# EasyEDA Pro project ProPrj_MSP3507拓展板_2025-07-14_10-12-05_2025-07-20.epro, schematic Schematic1
Board Name: Board1; Create Date: 2025-07-19; Page Name: P1; Project Name: MSP3507拓展板_2025-07-14_10-12-05; Schematic Name: Schematic1; Update Date: 2025-07-20; Add into BOM: yes; Company: 嘉立创EDA; Convert to PCB: yes; Page Size: A4; Version: V1.0
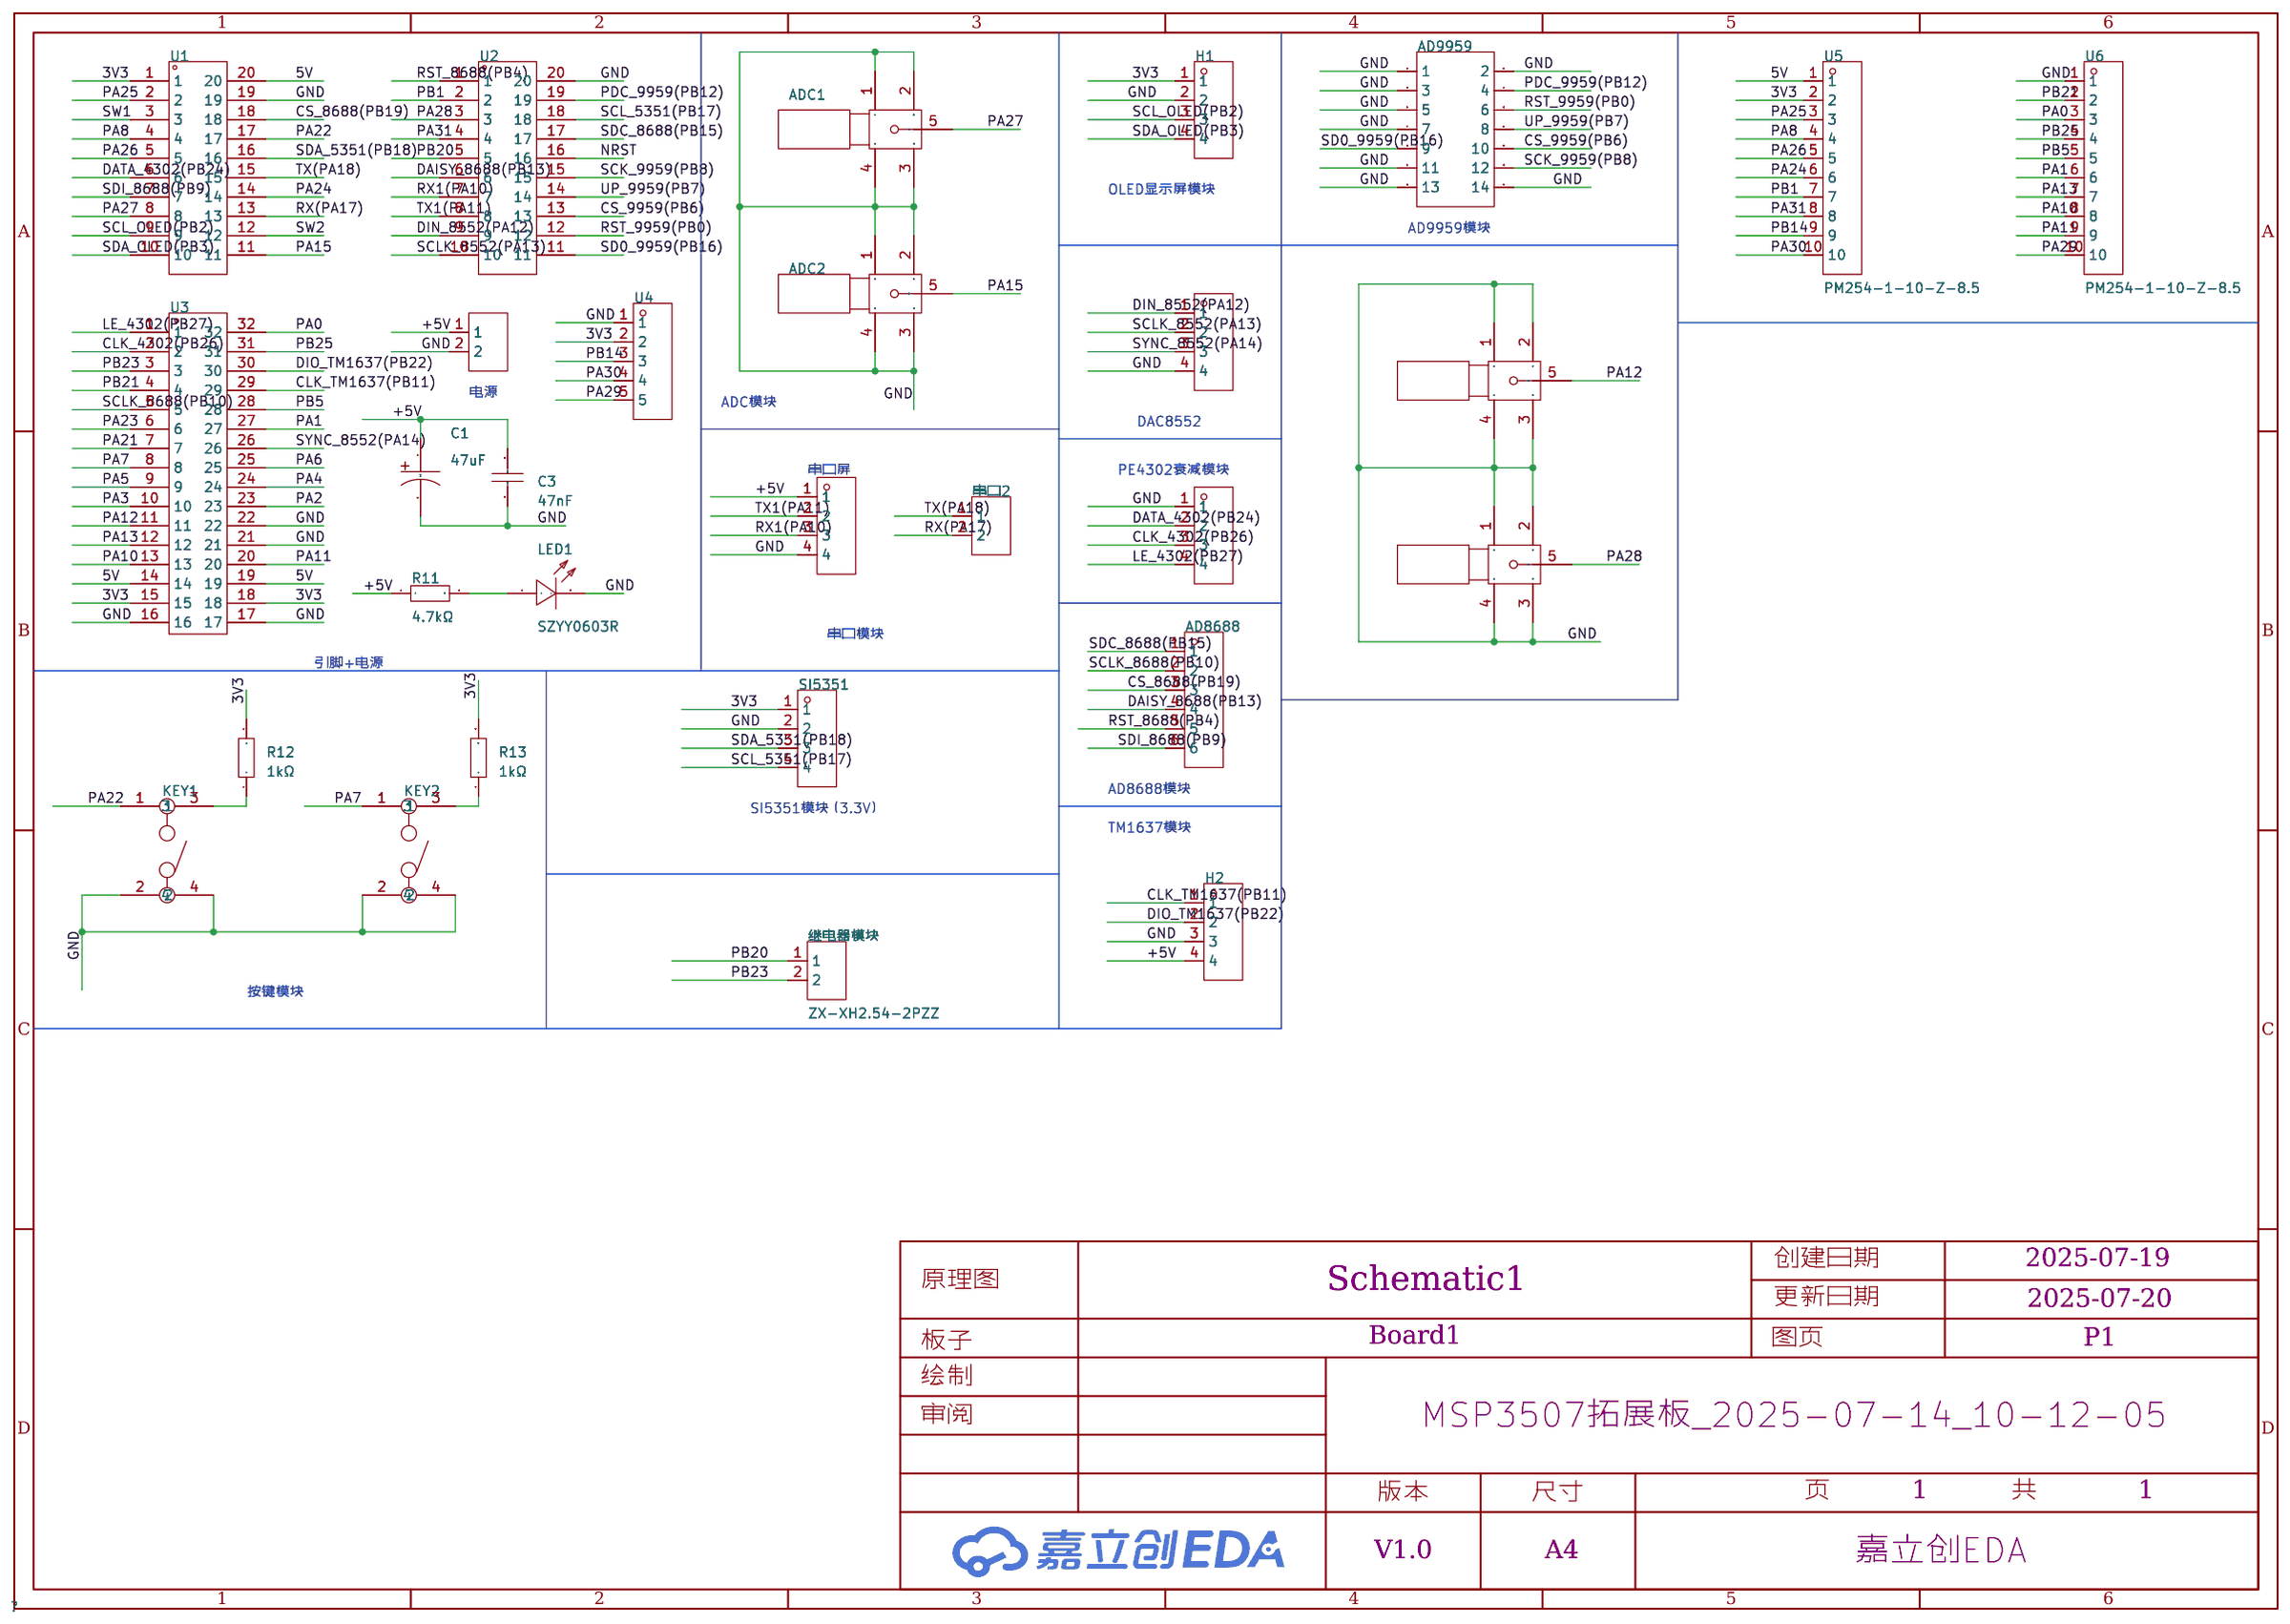
[diagram p0: schematic sheet]

## Parts
AD8688  ZX-XH2.54-6PZZ  [CONN-TH_6P-P2.50_ZX-XH2.54-6PZZ]
AD9959  2.54-2*7P简牛  [IDC-TH_14P-P2.54-V-R2-C7-S2.54]
ADC1  BWSMA-KE-P001  [SMA-SMD_BWSMA-KE-P001]
ADC2  BWSMA-KE-P001  [SMA-SMD_BWSMA-KE-P001]
C1  47uF  [CAP-TH_BD5.0-P2.00-D0.8-FD]
C3  47nF  [C0805]
DAC1  BWSMA-KE-P001  [SMA-SMD_BWSMA-KE-P001]
DAC2  BWSMA-KE-P001  [SMA-SMD_BWSMA-KE-P001]
H1  -  [HDR-TH_4P-P2.54-V-F]
H2  -  [HDR-TH_4P-P2.54-V-F]
KEY1  -  [4角直插式开关]
KEY2  -  [4角直插式开关]
LED1  SZYY0603R  [LED0603-R-RD]
OLED显示屏模块1  ZX-XH2.54-4PZZ  [CONN-TH_4P-P2.50_4PIN]
OLED显示屏模块2  ZX-XH2.54-4PZZ  [CONN-TH_4P-P2.50_4PIN]
OLED显示屏模块3  ZX-XH2.54-4PZZ  [CONN-TH_4P-P2.50_4PIN]
R11  4.7kΩ  [R0805]
R12  1kΩ  [R0805]
R13  1kΩ  [R0805]
SI5351  ZX-XH2.54-4PZZ  [CONN-TH_4P-P2.50_4PIN]
U1  -  [2*10Pin排针]
U2  -  [2*10Pin排针]
U3  -  [2*16Pin排针]
U4  PZ254V-11-05P  [HDR-TH_5P-P2.54-V-M]
U5  PM254-1-10-Z-8.5  [HDR-TH_10P-P2.54-V-F]
U6  PM254-1-10-Z-8.5  [HDR-TH_10P-P2.54-V-F]
串口1  ZX-XH2.54-2PZZ  [CONN-TH_2P-P2.50_HX25003-2A]
串口2  ZX-XH2.54-2PZZ  [CONN-TH_2P-P2.50_HX25003-2A]
继电器模块  ZX-XH2.54-2PZZ  [CONN-TH_2P-P2.50_HX25003-2A]

## Library data of the parts
AD8688 = ZX-XH2.54-6PZZ: 插针结构:1x6P;间距:2.5mm;安装方式:直插;参考系列:XH;总PIN数:6P;排数:1;每排PIN数:6;行距:-;额定电流:3A;触头材质:黄铜;触头镀层:锡;工作温度:-25℃~+85℃;; LCSC Part Name: 1x6P 间距:2.5mm 直插 系列:XH; Supplier Part: C7429636; Manufacturer: Megastar(兆星); Supplier Footprint: 插件,P=2.5mm; JLCPCB Part Class: 扩展库; Datasheet: https://atta.szlcsc.com/upload/public/pdf/source/20230619/1243AD0A516E39CD3D274D8985780568.pdf; Supplier: LCSC; Pins Structure: 1x6P; Pitch: 2.5mm; Mounting Type: 直插; Reference Series: XH; Number of Pins: 6P; Number of Rows: 1; Number of PINs Per Row: 6; Current Rating: 3A; Contact Material: 黄铜; Contact Plating: 锡; Operating Temperature: -25℃~+85℃; Voltage Rating: 250V; Plastic Material: PA66; Flame Retardant Rating: UL94V-0; Color: 白色; Z-Height of the Board: 7mm; X-Length of Bottom Edge on Board (Spacing Line): 17.5mm; Y-Width of Bottom Edge on Board: 5.9mm
AD9959 = 2.54-2*7P简牛: 连接器类型:简牛座;间距:2.54mm;结构:2x7P;封装形式:直插;行距:2.54mm;排数:2;每排PIN数:7;触头材质:黄铜;触头镀层:金;; LCSC Part Name: 2.54mm 2x7P 排数:2 每排P数:7; Supplier Part: C11215; Manufacturer: BOOMELE(博穆精密); Supplier Footprint: 插件,P=2.54mm; Datasheet: https://atta.szlcsc.com/upload/public/pdf/source/20131122/1457706661483.pdf; Supplier: LCSC; Connector Type: 简牛座; Pitch: 2.54mm; Structure: 2x7P; Holder Type: 直插; Row Spacing: 2.54mm; Number of Rows: 2; Pin Number in each Row: 7; Contact Material: 黄铜; Contact Plating: 金
ADC1 ADC2 DAC1 DAC2 = BWSMA-KE-P001: 连接器类型:板端;接口类型:内孔;端口数量:1;接口直径:5.2mm;接口长度/高度:-;频率-最大值:-;射频系列:SMA;阻抗:50Ω;样式:偏脚;工作温度范围:-;; LCSC Part Name: 内孔 SMA 偏脚; Supplier Part: C496550; Manufacturer: BAT WIRELESS(蝙蝠无线); Supplier Footprint: SMD; Datasheet: https://atta.szlcsc.com/upload/public/pdf/source/20240320/28FD502871C976DFF213ABFCF2A0ED51.pdf; Supplier: LCSC; Connector Type: 板端; Interface Type: 内孔; Number of Ports: 1; Interface Diameter: 5.2mm; RF Series: SMA; Impedance: 50Ω; Style: 偏脚
C1 = NXB25V47M5*11 2.5TP: 容值:47uF;精度:±20%;额定电压:25V;纹波电流:250mA@100kHz;等效串联电阻(ESR):300mΩ@100kHz;; LCSC Part Name: 47uF ±20% 25V; Supplier Part: C371230; Manufacturer: SAMYOUNG(韩国三莹); Supplier Footprint: 插件,D5xL11mm; JLCPCB Part Class: 扩展库; Datasheet: https://atta.szlcsc.com/upload/public/pdf/source/20190227/C371244_FA85FFEFC2961227CF12E3CCE8C34A7D.pdf; Supplier: LCSC; Tolerance: ±20%; Voltage Rating: 25V; Ripple Current: 250mA@100kHz; Equivalent Series Resistance(ESR): 300mΩ@100kHz; Pin Spacing: 2mm; Diameter: 5mm; Height - Seated (Max): 11mm; Lifetime: 2000hrs@105℃; Operating Temperature: -40℃~+105℃
C3 = CL21B473KBCNNNC: 容值:47nF;精度:±10%;额定电压:50V;材质(温度系数):X7R;; LCSC Part Name: 47nF ±10% 50V; Supplier Part: C53134; Manufacturer: SAMSUNG(三星); Supplier Footprint: 0805; JLCPCB Part Class: 基础库; Datasheet: https://atta.szlcsc.com/upload/public/pdf/source/20160218/1457707763339.pdf; Supplier: LCSC; Tolerance: ±10%; Voltage Rated: 50V; Temperature Coefficient: X7R
H1 H2 = HDR-F_2.54_1x4P: Supplier Part: C2718488; Supplier Footprint: 插件; JLCPCB Part Class: 扩展库
KEY1 KEY2 = 4角直插式开关: 4.5*4.5*3.8
LED1 = SZYY0603R: 发光颜色:红色;功率:40mW;正向电流:20mA;主波长:615nm~630nm;二极管配置:-;透镜颜色:无色透明透镜;色温:-;发光角度:120°;载带方式:-;工作温度:-40℃~+85℃;; LCSC Part Name: 红灯; Supplier Part: C434419; Manufacturer: yongyu(永裕光电); Supplier Footprint: 0603; JLCPCB Part Class: 扩展库; Datasheet: https://atta.szlcsc.com/upload/public/pdf/source/20191204/C434419_0B955C1F73FF88449D9A795B6FF49070.pdf; Supplier: LCSC; Emitted Color: 红色; Power Dissipation: 40mW; Forward Current: 20mA; Dominant Wavelength: 615nm~630nm; Peak Wavelength: 645nm; Lens Color: 无色透明透镜; Viewing Angle: 120°; Operating Temperature: -40℃~+85℃
OLED显示屏模块1-OLED显示屏模块3 SI5351 = ZX-XH2.54-4PZZ: 插针结构:1x4P;间距:2.5mm;安装方式:直插;参考系列:XH;总PIN数:4P;排数:1;每排PIN数:4;行距:-;额定电流:3A;触头材质:黄铜;触头镀层:锡;工作温度:-25℃~+85℃;; LCSC Part Name: 1x4P 间距:2.5mm 直插 系列:XH; Supplier Part: C7429634; Manufacturer: Megastar(兆星); Supplier Footprint: 插件,P=2.5mm; JLCPCB Part Class: 扩展库; Datasheet: https://atta.szlcsc.com/upload/public/pdf/source/20230619/B529A2163E0159A644AB3383D208FB03.pdf; Supplier: LCSC; Pins Structure: 1x4P; Pitch: 2.5mm; Mounting Type: 直插; Reference Series: XH; Number of Pins: 4P; Number of Rows: 1; Number of PINs Per Row: 4; Current Rating: 3A; Contact Material: 黄铜; Contact Plating: 锡; Operating Temperature: -25℃~+85℃; Voltage Rating: 250V; Plastic Material: PA66; Flame Retardant Rating: UL94V-0; Color: 白色; Z-Height of the Board: 7mm; X-Length of Bottom Edge on Board (Spacing Line): 12.5mm; Y-Width of Bottom Edge on Board: 5.9mm
R11 = 0805W8F4701T5E: 电阻类型:厚膜电阻;阻值:4.7kΩ;精度:±1%;功率:125mW;最大工作电压:150V;温度系数:±100ppm/℃;; LCSC Part Name: 4.7kΩ ±1% 125mW 厚膜电阻; Supplier Part: C17673; Manufacturer: UNI-ROYAL(厚声); Supplier Footprint: 0805; JLCPCB Part Class: 基础库; Datasheet: https://atta.szlcsc.com/upload/public/pdf/source/20200306/C422600_1E6D84923E4A46A82E41ADD87F860B5C.pdf; Supplier: LCSC; Type: 厚膜电阻; Tolerance: ±1%; Power(Watts): 125mW; Overload Voltage (Max): 150V; Temperature Coefficient: ±100ppm/℃; Operating Temperature Range: -55℃~+155℃
R12 R13 = 0805W8F1001T5E: 电阻类型:厚膜电阻;阻值:1kΩ;精度:±1%;功率:125mW;温度系数:±100ppm/℃;最大工作电压:150V;工作温度范围:-55℃~+155℃;; LCSC Part Name: 1kΩ ±1% 125mW; Supplier Part: C17513; Manufacturer: UNI-ROYAL(厚声); Supplier Footprint: 0805; JLCPCB Part Class: Basic Part; Datasheet: https://atta.szlcsc.com/upload/public/pdf/source/20200306/C422600_1E6D84923E4A46A82E41ADD87F860B5C.pdf; Supplier: LCSC; Type: 厚膜电阻; Tolerance: ±1%; Power(Watts): 125mW; Temperature Coefficient: ±100ppm/℃; Overload Voltage (Max): 150V; Operating Temperature Range: -55℃~+155℃
U1 U2 = 2*10Pin排针: 2.54
U3 = 2*16Pin排针: 2.54
U4 = PZ254V-11-05P: 间距:2.54mm;总PIN位数:5;排数:1;插针结构:1x5P;行距:-;安装类型:直插;圆针/方针:方针;额定电流:-;额定电压:-;配合针长度:6mm;塑高:2.5mm;端接针长度:3mm;触头材质:黄铜;触头镀层:-;工作温度范围:-40℃~+105℃;颜色:黑色;; LCSC Part Name: 2.54mm 1x5P 直插 方针; Supplier Part: C492404; Manufacturer: XFCN(兴飞); Supplier Footprint: 直插,P=2.54mm; JLCPCB Part Class: Extended Part; Datasheet: https://atta.szlcsc.com/upload/public/pdf/source/20200309/C492404_E51533260F8710EFF5D4617281164C1D.pdf; Supplier: LCSC; Pitch: 2.54mm; Number of Pins: 5; Number of Rows: 1; Pin Structure: 1x5P; Mounting Type: 直插; Circluar Pins/Square Pins: 方针; Length of Mating Pin: 6mm; Insulation Height: 2.5mm; Length of End Connection Pin: 3mm; Contact Material: 黄铜; Operating Temperature Range: -40℃~+105℃; Color: 黑色
U5 U6 = PM254-1-10-Z-8.5: 插孔结构:1x10P;间距:2.54mm;行距:-;圆孔/方孔:方孔;安装类型:直插;排数:单排;总孔位数:10P;额定电流:3A;额定电压:-;插孔方向:顶部;塑高:8.5mm;触头材质:铜合金;工作温度范围:-40℃~+105℃;焊接温度(最大值):260℃@5S;; LCSC Part Name: 1x10P 间距:2.54mm 直插; Supplier Part: C2897373; Manufacturer: HCTL(华灿天禄); Supplier Footprint: 插件,P=2.54mm; JLCPCB Part Class: 扩展库; Datasheet: https://atta.szlcsc.com/upload/public/pdf/source/20230609/534BE42964C679BDE98E061007C4ABD6.pdf; Supplier: LCSC; Holes Structure: 1x10P; Pitch: 2.54mm; Circular Hole / Square Hole: 方孔; Mounting Type: 直插; Number of Rows: 单排; Number of Holes: 10P; Current Rating (Max): 3A; Holes Direction: 顶部; Insulation Height: 8.5mm; Contact Material: 铜合金; Operating Temperature Range: -40℃~+105℃; Soldering Temperature(Max): 260℃@5S
串口1 串口2 继电器模块 = ZX-XH2.54-2PZZ: 插针结构:1x2P;间距:2.5mm;安装方式:直插;参考系列:XH;总PIN数:2P;排数:1;每排PIN数:2;行距:-;额定电流:3A;触头材质:黄铜;触头镀层:锡;工作温度:-25℃~+85℃;; LCSC Part Name: 1x2P 间距:2.5mm 直插 系列:XH; Supplier Part: C7429632; Manufacturer: Megastar(兆星); Supplier Footprint: 插件,P=2.5mm; JLCPCB Part Class: 扩展库; Datasheet: https://atta.szlcsc.com/upload/public/pdf/source/20230619/19BA6947230AA44A04D3EDD65E618FD0.pdf; Supplier: LCSC; Pins Structure: 1x2P; Pitch: 2.5mm; Mounting Type: 直插; Reference Series: XH; Number of Pins: 2P; Number of Rows: 1; Number of PINs Per Row: 2; Current Rating: 3A; Contact Material: 黄铜; Contact Plating: 锡; Operating Temperature: -25℃~+85℃; Voltage Rating: 250V; Plastic Material: PA66; Flame Retardant Rating: UL94V-0; Color: 白色; Z-Height of the Board: 7mm; X-Length of Bottom Edge on Board (Spacing Line): 7.5mm; Y-Width of Bottom Edge on Board: 5.9mm

## Nets
3V3: H1.1 R12.2 R13.2 SI5351.1 U1.1 U3.15 U3.18 U4.2 U5.2
5V: U1.20 U3.14 U3.19 U5.1
+5V: C1.1 C3.2 H2.4 OLED显示屏模块2.1 R11.1 串口1.1
GND: AD9959.1 AD9959.2 AD9959.3 AD9959.5 AD9959.7 AD9959.11 AD9959.13 AD9959.14 ADC1.1 ADC1.2 ADC1.3 ADC1.4 ADC2.1 ADC2.2 ADC2.3 ADC2.4 C1.2 C3.1 DAC1.1 DAC1.2 DAC1.3 DAC1.4 DAC2.1 DAC2.2 DAC2.3 DAC2.4 H1.2 H2.3 KEY1.2 KEY1.4 KEY2.2 KEY2.4 LED1.2(-) OLED显示屏模块1.1 OLED显示屏模块2.4 OLED显示屏模块3.4 SI5351.2 U1.19 U2.20 U3.16 U3.17 U3.21 U3.22 U4.1 U6.1 串口1.2
CLK_4302(PB26): OLED显示屏模块1.3 U3.2
CLK_TM1637(PB11): H2.1 U3.29
CS_8688(PB19): AD8688.3 U1.18
CS_9959(PB6): AD9959.10 U2.13
DAISY_8688(PB13): AD8688.4 U2.6
DATA_4302(PB24): OLED显示屏模块1.2 U1.6
DIN_8552(PA12): OLED显示屏模块3.1 U2.9
DIO_TM1637(PB22): H2.2 U3.30
LE_4302(PB27): OLED显示屏模块1.4 U3.1
NRST: U2.16
PA0: U3.32 U6.3
PA1: U3.27 U6.6
PA2: U3.23
PA3: U3.10
PA4: U3.24
PA5: U3.9
PA6: U3.25
PA7: KEY2.1 U3.8
PA8: U1.4 U5.4
PA10: U3.13 U6.8
PA11: U3.20 U6.9
PA12: DAC1.5 U3.11
PA13: U3.12 U6.7
PA15: ADC2.5 U1.11
PA21: U3.7
PA22: KEY1.1 U1.17
PA23: U3.6
PA24: U1.14 U5.6
PA25: U1.2 U5.3
PA26: U1.5 U5.5
PA27: ADC1.5 U1.8
PA28: DAC2.5 U2.3
PA29: U4.5 U6.10
PA30: U4.4 U5.10
PA31: U2.4 U5.8
PB1: U2.2 U5.7
PB5: U3.28 U6.5
PB14: U4.3 U5.9
PB20: U2.5 继电器模块.1
PB21: U3.4 U6.2
PB23: U3.3 继电器模块.2
PB25: U3.31 U6.4
PDC_9959(PB12): AD9959.4 U2.19
RST_8688(PB4): AD8688.5 U2.1
RST_9959(PB0): AD9959.6 U2.12
RX1(PA10): OLED显示屏模块2.3 U2.7
RX(PA17): U1.13 串口2.2
SCK_9959(PB8): AD9959.12 U2.15
SCL_5351(PB17): SI5351.4 U2.18
SCL_OLED(PB2): H1.3 U1.9
SCLK_8552(PA13): OLED显示屏模块3.2 U2.10
SCLK_8688(PB10): AD8688.2 U3.5
SD0_9959(PB16): AD9959.9 U2.11
SDA_5351(PB18): SI5351.3 U1.16
SDA_OLED(PB3): H1.4 U1.10
SDC_8688(PB15): AD8688.1 U2.17
SDI_8688(PB9): AD8688.6 U1.7
SW1: U1.3
SW2: U1.12
SYNC_8552(PA14): OLED显示屏模块3.3 U3.26
TX1(PA11): OLED显示屏模块2.2 U2.8
TX(PA18): U1.15 串口2.1
UP_9959(PB7): AD9959.8 U2.14
$1N1385: LED1.1(+) R11.2
$1N2419: KEY1.3 R12.1
$1N2433: KEY2.3 R13.1

## Notes on the sheet
- OLED显示屏模块
- AD9959模块
- 电源
- ADC模块
- DAC8552
- 串口屏
- PE4302衰减模块
- 串口模块
- 引脚+电源
- AD8688模块
- SI5351模块（3.3V）
- TM1637模块
- 按键模块
